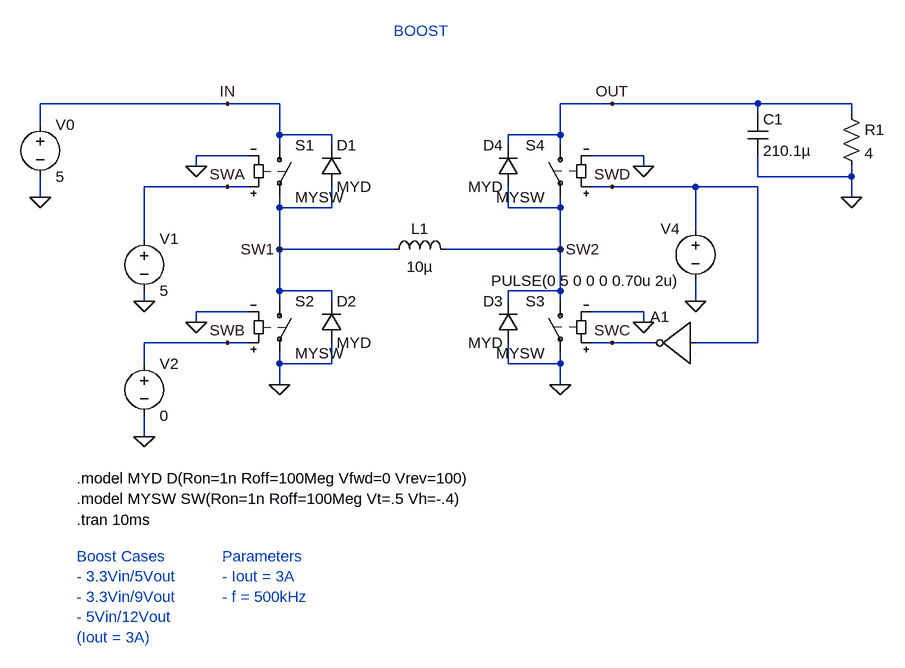
[diagram p0: schematic boost_power_circuit.asc]
boost_power_circuit.asc, the LTspice schematic file:
Version 4
SHEET 1 4260 880
WIRE -16 -256 -304 -256
WIRE 64 -256 -16 -256
WIRE 576 -256 496 -256
WIRE 800 -256 576 -256
WIRE 944 -256 800 -256
WIRE 800 -240 800 -256
WIRE 944 -240 944 -256
WIRE -304 -224 -304 -256
WIRE 64 -208 64 -256
WIRE 144 -208 64 -208
WIRE 496 -208 496 -256
WIRE 496 -208 416 -208
WIRE 64 -192 64 -208
WIRE 144 -192 144 -208
WIRE 416 -192 416 -208
WIRE 496 -192 496 -208
WIRE 16 -176 -64 -176
WIRE 624 -176 544 -176
WIRE -64 -160 -64 -176
WIRE 624 -160 624 -176
WIRE 800 -144 800 -176
WIRE 944 -144 944 -160
WIRE 944 -144 800 -144
WIRE -16 -128 -144 -128
WIRE 16 -128 -16 -128
WIRE 576 -128 544 -128
WIRE 704 -128 576 -128
WIRE 800 -128 704 -128
WIRE -304 -112 -304 -144
WIRE 944 -112 944 -144
WIRE 64 -96 64 -112
WIRE 144 -96 144 -128
WIRE 144 -96 64 -96
WIRE 416 -96 416 -128
WIRE 496 -96 496 -112
WIRE 496 -96 416 -96
WIRE 704 -64 704 -128
WIRE -144 -48 -144 -128
WIRE 64 -32 64 -96
WIRE 240 -32 64 -32
WIRE 496 -32 496 -96
WIRE 496 -32 320 -32
WIRE 64 32 64 -32
WIRE 144 32 64 32
WIRE 496 32 496 -32
WIRE 496 32 416 32
WIRE -144 48 -144 32
WIRE 64 48 64 32
WIRE 144 48 144 32
WIRE 416 48 416 32
WIRE 496 48 496 32
WIRE 704 48 704 16
WIRE 16 64 -64 64
WIRE 624 64 544 64
WIRE -64 80 -64 64
WIRE 624 80 624 64
WIRE -16 112 -144 112
WIRE 16 112 -16 112
WIRE 576 112 544 112
WIRE 640 112 576 112
WIRE 800 112 800 -128
WIRE 800 112 704 112
WIRE -144 144 -144 112
WIRE 64 144 64 128
WIRE 144 144 144 112
WIRE 144 144 64 144
WIRE 416 144 416 112
WIRE 496 144 496 128
WIRE 496 144 416 144
WIRE 64 176 64 144
WIRE 496 176 496 144
WIRE -144 256 -144 224
FLAG 944 -112 0
FLAG 496 176 0
FLAG 64 176 0
FLAG 576 -256 OUT
FLAG 704 48 0
FLAG -304 -112 0
FLAG -16 -256 IN
FLAG 64 -32 SW1
FLAG -144 48 0
FLAG 496 -32 SW2
FLAG 576 -128 SWD
FLAG 576 112 SWC
FLAG -16 -128 SWA
FLAG -16 112 SWB
FLAG -144 256 0
FLAG -64 -160 0
FLAG -64 80 0
FLAG 624 -160 0
FLAG 624 80 0
SYMBOL cap 784 -240 R0
SYMATTR InstName C1
SYMATTR Value 210.1µ
SYMBOL ind 224 -16 R270
WINDOW 0 32 56 VTop 2
WINDOW 3 5 56 VBottom 2
SYMATTR InstName L1
SYMATTR Value 10µ
SYMBOL voltage 704 -80 M0
WINDOW 123 0 0 Left 0
WINDOW 39 0 0 Left 0
SYMATTR InstName V4
SYMATTR Value PULSE(0 5 0 0 0 0.70u 2u)
SYMBOL voltage -144 -64 R0
WINDOW 123 0 0 Left 0
WINDOW 39 0 0 Left 0
SYMATTR InstName V1
SYMATTR Value 5
SYMBOL voltage -304 -240 R0
WINDOW 123 0 0 Left 0
WINDOW 39 0 0 Left 0
SYMATTR InstName V0
SYMATTR Value 5
SYMBOL res 928 -256 R0
SYMATTR InstName R1
SYMATTR Value 4
SYMBOL voltage -144 128 R0
WINDOW 123 0 0 Left 0
WINDOW 39 0 0 Left 0
SYMATTR InstName V2
SYMATTR Value 0
SYMBOL sw 64 -208 R0
SYMATTR InstName S1
SYMATTR Value MYSW
SYMBOL sw 64 32 R0
SYMATTR InstName S2
SYMATTR Value MYSW
SYMBOL sw 496 32 M0
SYMATTR InstName S3
SYMATTR Value MYSW
SYMBOL sw 496 -208 M0
SYMATTR InstName S4
SYMATTR Value MYSW
SYMBOL Digital\\inv 704 48 M0
SYMATTR InstName A1
SYMBOL diode 128 -128 M180
WINDOW 0 24 64 Left 2
WINDOW 3 24 0 Left 2
SYMATTR InstName D1
SYMATTR Value MYD
SYMBOL diode 128 112 M180
WINDOW 0 24 64 Left 2
WINDOW 3 24 0 Left 2
SYMATTR InstName D2
SYMATTR Value MYD
SYMBOL diode 432 112 R180
WINDOW 0 24 64 Left 2
WINDOW 3 24 0 Left 2
SYMATTR InstName D3
SYMATTR Value MYD
SYMBOL diode 432 -128 R180
WINDOW 0 24 64 Left 2
WINDOW 3 24 0 Left 2
SYMATTR InstName D4
SYMATTR Value MYD
TEXT -248 440 Left 2 ;Boost Cases\n- 3.3Vin/5Vout\n- 3.3Vin/9Vout\n- 5Vin/12Vout\n(Iout = 3A)
TEXT -24 440 Left 2 ;Parameters\n- Iout = 3A\n- f = 500kHz
TEXT -248 384 Left 2 !.tran 10ms
TEXT -248 352 Left 2 !.model MYSW SW(Ron=1n Roff=100Meg Vt=.5 Vh=-.4)
TEXT -248 320 Left 2 !.model MYD D(Ron=1n Roff=100Meg Vfwd=0 Vrev=100)
TEXT 240 -368 Left 2 ;BOOST

The netlist it stands for:
* boost_power_circuit.asc
C1 OUT 0 210.1µ
L1 SW1 SW2 10µ
V4 SWD 0 PULSE(0 5 0 0 0 0.70u 2u)
V1 SWA 0 5
V0 IN 0 5
R1 OUT 0 4
V2 SWB 0 0
S1 IN SW1 SWA 0 MYSW
S2 SW1 0 SWB 0 MYSW
S3 SW2 0 SWC 0 MYSW
S4 OUT SW2 SWD 0 MYSW
A1 SWD 0 0 0 0 SWC 0 0 BUF
D1 SW1 IN MYD
D2 0 SW1 MYD
D3 0 SW2 MYD
D4 SW2 OUT MYD
.model D D
.lib standard.dio
* Boost Cases
* - 3.3Vin/5Vout
* - 3.3Vin/9Vout
* - 5Vin/12Vout
* (Iout = 3A)
* Parameters
* - Iout = 3A
* - f = 500kHz
.tran 10ms
.model MYSW SW(Ron=1n Roff=100Meg Vt=.5 Vh=-.4)
.model MYD D(Ron=1n Roff=100Meg Vfwd=0 Vrev=100)
* BOOST
.backanno
.end